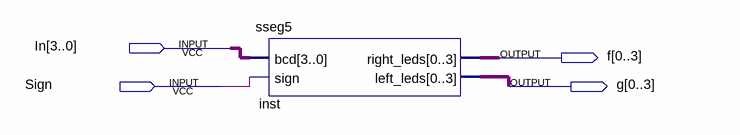
[diagram p0: schematic sheet]
// Quartus schematic SevenSegment.bdf as structural Verilog: 1 symbols, 4 pins
module SevenSegment (
  input  [3:0] In,
  input  Sign,
  output [0:3] f,
  output [0:3] g
);

  sseg5 inst (.bcd(In), .sign(Sign), .right_leds(f), .left_leds(g));
endmodule
